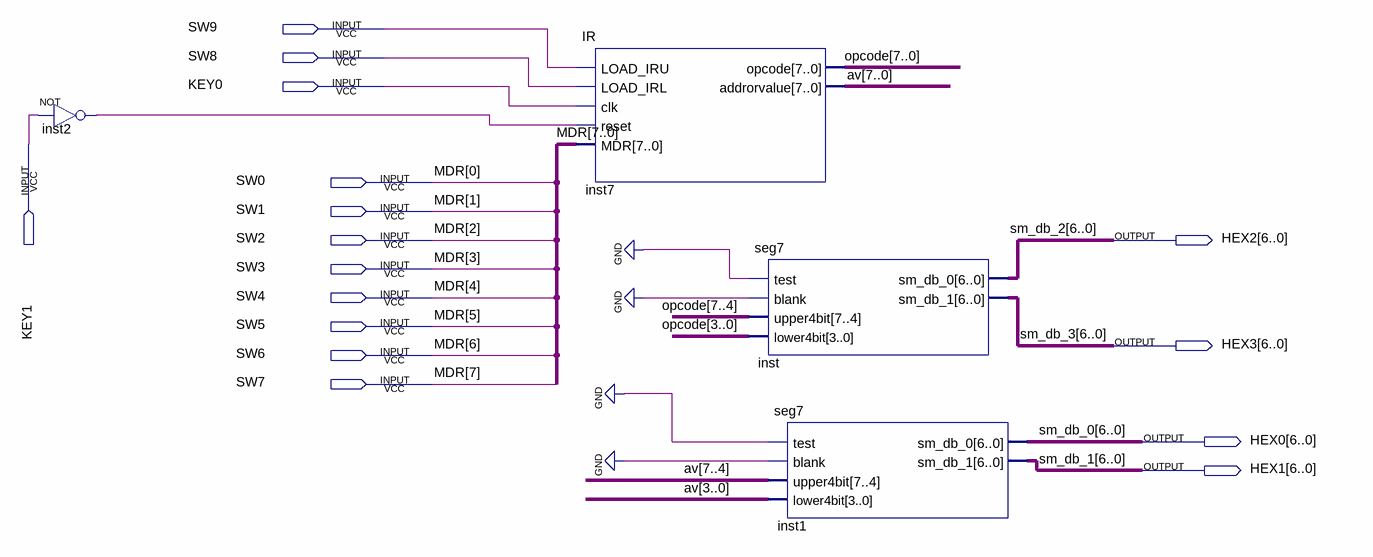
[diagram p0: schematic sheet]
// Quartus schematic IR_tb.bdf as structural Verilog: 4 symbols, 16 pins
module IR_tb (
  input  SW9,
  input  SW8,
  input  KEY0,
  input  KEY1,
  input  SW0,
  input  SW1,
  input  SW2,
  input  SW3,
  input  SW4,
  input  SW5,
  input  SW6,
  input  SW7,
  output [6:0] HEX2,
  output [6:0] HEX3,
  output [6:0] HEX0,
  output [6:0] HEX1
);

  wire inst2_out;
  wire [7:0] av, opcode;

  not inst2 (inst2_out, KEY1);
  IR inst7 (
    .LOAD_IRU(SW9), .LOAD_IRL(SW8), .clk(KEY0), .reset(inst2_out),
    .MDR({SW7, SW6, SW5, SW4, SW3, SW2, SW1, SW0}), .opcode(opcode), .addrorvalue(av));
  seg7 inst (
    .test(1'b0), .blank(1'b0), .upper4bit(opcode[7:4]), .lower4bit(opcode[3:0]), .sm_db_0(HEX2),
    .sm_db_1(HEX3));
  seg7 inst1 (.test(1'b0), .blank(1'b0), .upper4bit(av[7:4]), .lower4bit(av[3:0]), .sm_db_0(HEX0), .sm_db_1(HEX1));

  // Other names for the same wires on the sheet: MDR[7:0] = {SW7, SW6, SW5, SW4, SW3, SW2, SW1, SW0};
  //   sm_db_0[6:0] = HEX0; sm_db_1[6:0] = HEX1; sm_db_2[6:0] = HEX2; sm_db_3[6:0] = HEX3
endmodule
